# Altium schematic sheet schematic.SchDoc
size A3
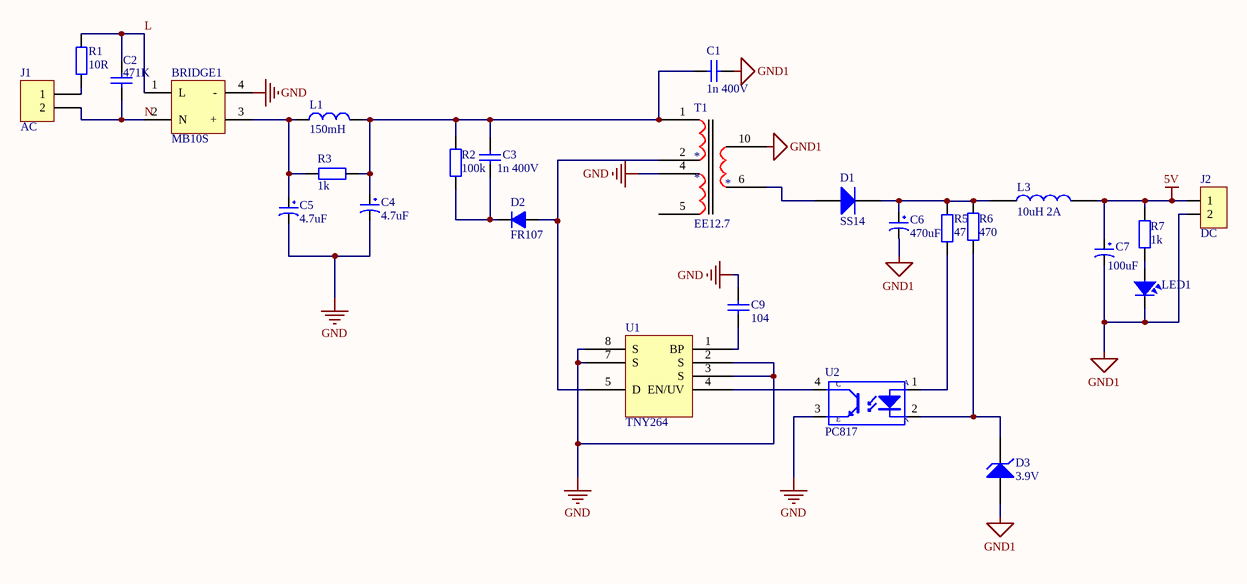
[diagram p0: schematic.SchDoc]

## Parts
BRIDGE1  MB10S  [DBS10]
C1  1n 400V  [CN2]
C2  471K  [MOV-14D(5.2MM-T)]
C3  1n 400V  [CN2]
C4  4.7uF  [tu hoa 8mm]
C5  4.7uF  [tu hoa 8mm]
C6  470uF  [tu hoa 8mm]
C7  100uF  [TU HOA 100uF 16V]
C9  104  [Tu 0805]
D1  SS14  [DIODE SMD]
D2  FR107  [RES-1WD]
D3  3.9V  [RES-1/4WD]
J1  AC  [HED2]
J2  DC  [JP2]
L1  150mH  [R1/4W1]
L3  10uH 2A  [CUON CAM 100uH3A]
LED1  LED  [LED-3]  (value not drawn)
R1  10R  [RES-1WD]
R2  100k  [SM-RES-0805]
R3  1k  [SM-RES-0805]
R5  47  [SM-RES-0805]
R6  value 470  [SM-RES-0805]  (hidden comment: 470R)
R7  1k  [SM-RES-0805]
T1  EE12.7  [EE13]
U1  TNY264  [DIP8]
U2  PC817  [OPTO]

## Nets
5V: C7.1 J2.1 L3.2 R7.2
GND: BRIDGE1.4(-) C4.2 C5.2 C9.2 T1.4 U1.2(S) U1.3(S) U1.7(S) U1.8(S) U2.3(E)
GND1: C1.1 C6.2 C7.2 D3.1(A) J2.2 LED1.2 T1.10
L: BRIDGE1.1(L) C2.2 R1.2
N: BRIDGE1.2(N) C2.1 J1.2
NetBRIDGE1_3: BRIDGE1.3(+) C5.1 L1.1 R3.1
NetC1_2: C1.2 C3.1 C4.1 L1.2 R2.1 R3.2 T1.1
NetC3_2: C3.2 D2.2(K) R2.2
NetC6_1: C6.1 D1.2(K) L3.1 R5.2 R6.2
NetC9_1: C9.1 U1.1(BP)
NetD1_1: D1.1(A) T1.6
NetD2_1: D2.1(A) T1.2 U1.5(D)
NetD3_2: D3.2(K) R6.1 U2.2(K)
NetJ1_1: J1.1 R1.1
NetLED1_1: LED1.1 R7.1
NetR5_1: R5.1 U2.1(A)
NetU1_4: U1.4(EN/UV) U2.4(C)

Not connected (* = marked no-connect by the designer): T1 5

## Library data of the parts
C1 C3 = Cap2KV: Published: 8-Jun-2000; LatestRevisionDate: 17-Jul-2002; LatestRevisionNote: Re-released for DXP Platform.; PackageReference: RAD-0.3; Publisher: Altium Limited
C2 = MOV
C4 C5 = Tu Hoa 4.7uF 400V 8x12: Cắm; Don_Vi: Con; So_Chan: 2; Ten_Linh_Kien: Tụ Hóa 4.7uF 400V 8x12MM; Ma_Hang: MH003744; Chung_Loai: Cắm; Kieu_Chan: *
C6 = Tu Hoa 470uF 16V 8x11: Cắm; Don_Vi: Con; So_Chan: 2; Ten_Linh_Kien: Tụ Hóa 470uF 16V 8x11MM; Ma_Hang: MH006550; Chung_Loai: Cắm; Kieu_Chan: *
C7 = CP3: Cap 100uF/35V - 470uF/16V; Value: 100uF/35V/50V; Description 1: 1000uF/6,3V - 470uF/16V - 330uF - 25V; Description 2: 220uF/35V - 100uF/50V - 63V - 4,7uF/200V; Description 3: 22uF => 33uF100V - 3,3uF => 4,7uF/250V; Description 4: 2,2uF =>3,3uF/350 - 2,2uF/400V - 1uF/450V
C9 = Tu 104: Dán; Ten_Linh_Kien: Tụ 0805 104-100nF 10% 50V; Don_Vi: Con; Ma_Hang: MH004551; Kieu_Chan: *; Chung_Loai: Dán; Ghi_Chu: *
D1 = Diode SS14 ( 1N5819): Dán; Ma_Hang: MH002211; Don_Vi: Con; Ten_Linh_Kien: Diode SS14 DO214 Schottky 1A 40V ( 1N5819 DO214); Chung_Loai: Dán; Ghi_Chu: *; Kieu_Chan: *
D2 = D1A: Diode 1A; Value: 1N4007
D3 = Diode Zener: Zener Diode; Published: 8-Jun-2000; LatestRevisionDate: 17-Jul-2002; LatestRevisionNote: Re-released for DXP Platform.; PackageReference: DIODE-0.7; Publisher: Altium Limited
J1 = KF2: Manufacturer: Würth Elektronik eiSos GmbH; partNo: 691103110002; ComponentLink1 Description: Manufacturer; ComponentLink2 Description: Datasheet; NoPins: 2; Created Date: 29 October 2013; ComponentLink1URL: http://www.we-online.com; ComponentLink2URL: http://katalog.we-online.de/em/datasheet/6911031100xx.pdf; Created by: Karrer Zheng
J2 = JP2: WR-PHD 2.54 mm Angled Socket Header; Manufacturer: W¨¹rth Elektronik eiSos GmbH; partNo: 613002143121; ComponentLink1 Description: Manufacturer; ComponentLink2 Description: Datasheet; NoPins: 02; Created Date: 29 March 2013; ComponentLink1URL: http://www.we-online.com; ComponentLink2URL: http://katalog.we-online.de/em/datasheet/6130xx143121.pdf; Created by: Karrer Zheng
L1 = L1: Inductor; Value: 150 mH
L3 = CUON CAM 470uH DIP: Cắm; Don_Vi: Con; Ma_Hang: MH002232; Ten_Linh_Kien: Cuộn Cảm 470uH 3A 8x10MM; Ghi_Chu: *; Kieu_Chan: *; Chung_Loai: Cắm
LED1 = LED: LED Single colour Green and Red; Value: LED 3 ly Single Colour
R1 = Tro Vach 1W 5% 10R: Cắm; Don_Vi: Con; So_Chan: 2; Ten_Linh_Kien: Trở 5% 1w 10R; Ma_Hang: MH006392; Chung_Loai: Cắm; Kieu_Chan: *
R2 R6 R7 = R0805: Resistor SMD 0805; Published: 8-Jun-2000; LatestRevisionDate: 17-Jul-2002; LatestRevisionNote: Re-released for DXP Platform.; PackageReference: AXIAL-0.4; Publisher: Altium Limited
  R2: Value: 100k
  R7: Value: 1k
R3 = R1/4W: Resistor 1/4W; Value: R1/4W - 1K
R5 = Tro 0805 5% 47R: Dán; Don_Vi: Con; So_Chan: 2; Ten_Linh_Kien: Trở 0805 5% 47R; Ma_Hang: MH005321; Chung_Loai: Dán; Kieu_Chan: *
T1 = Tranformer
U2 = OPTO: Single Opto; Value: TLP5211